# EAGLE design reLoaD_Spinner (EAGLE 9.7.0)
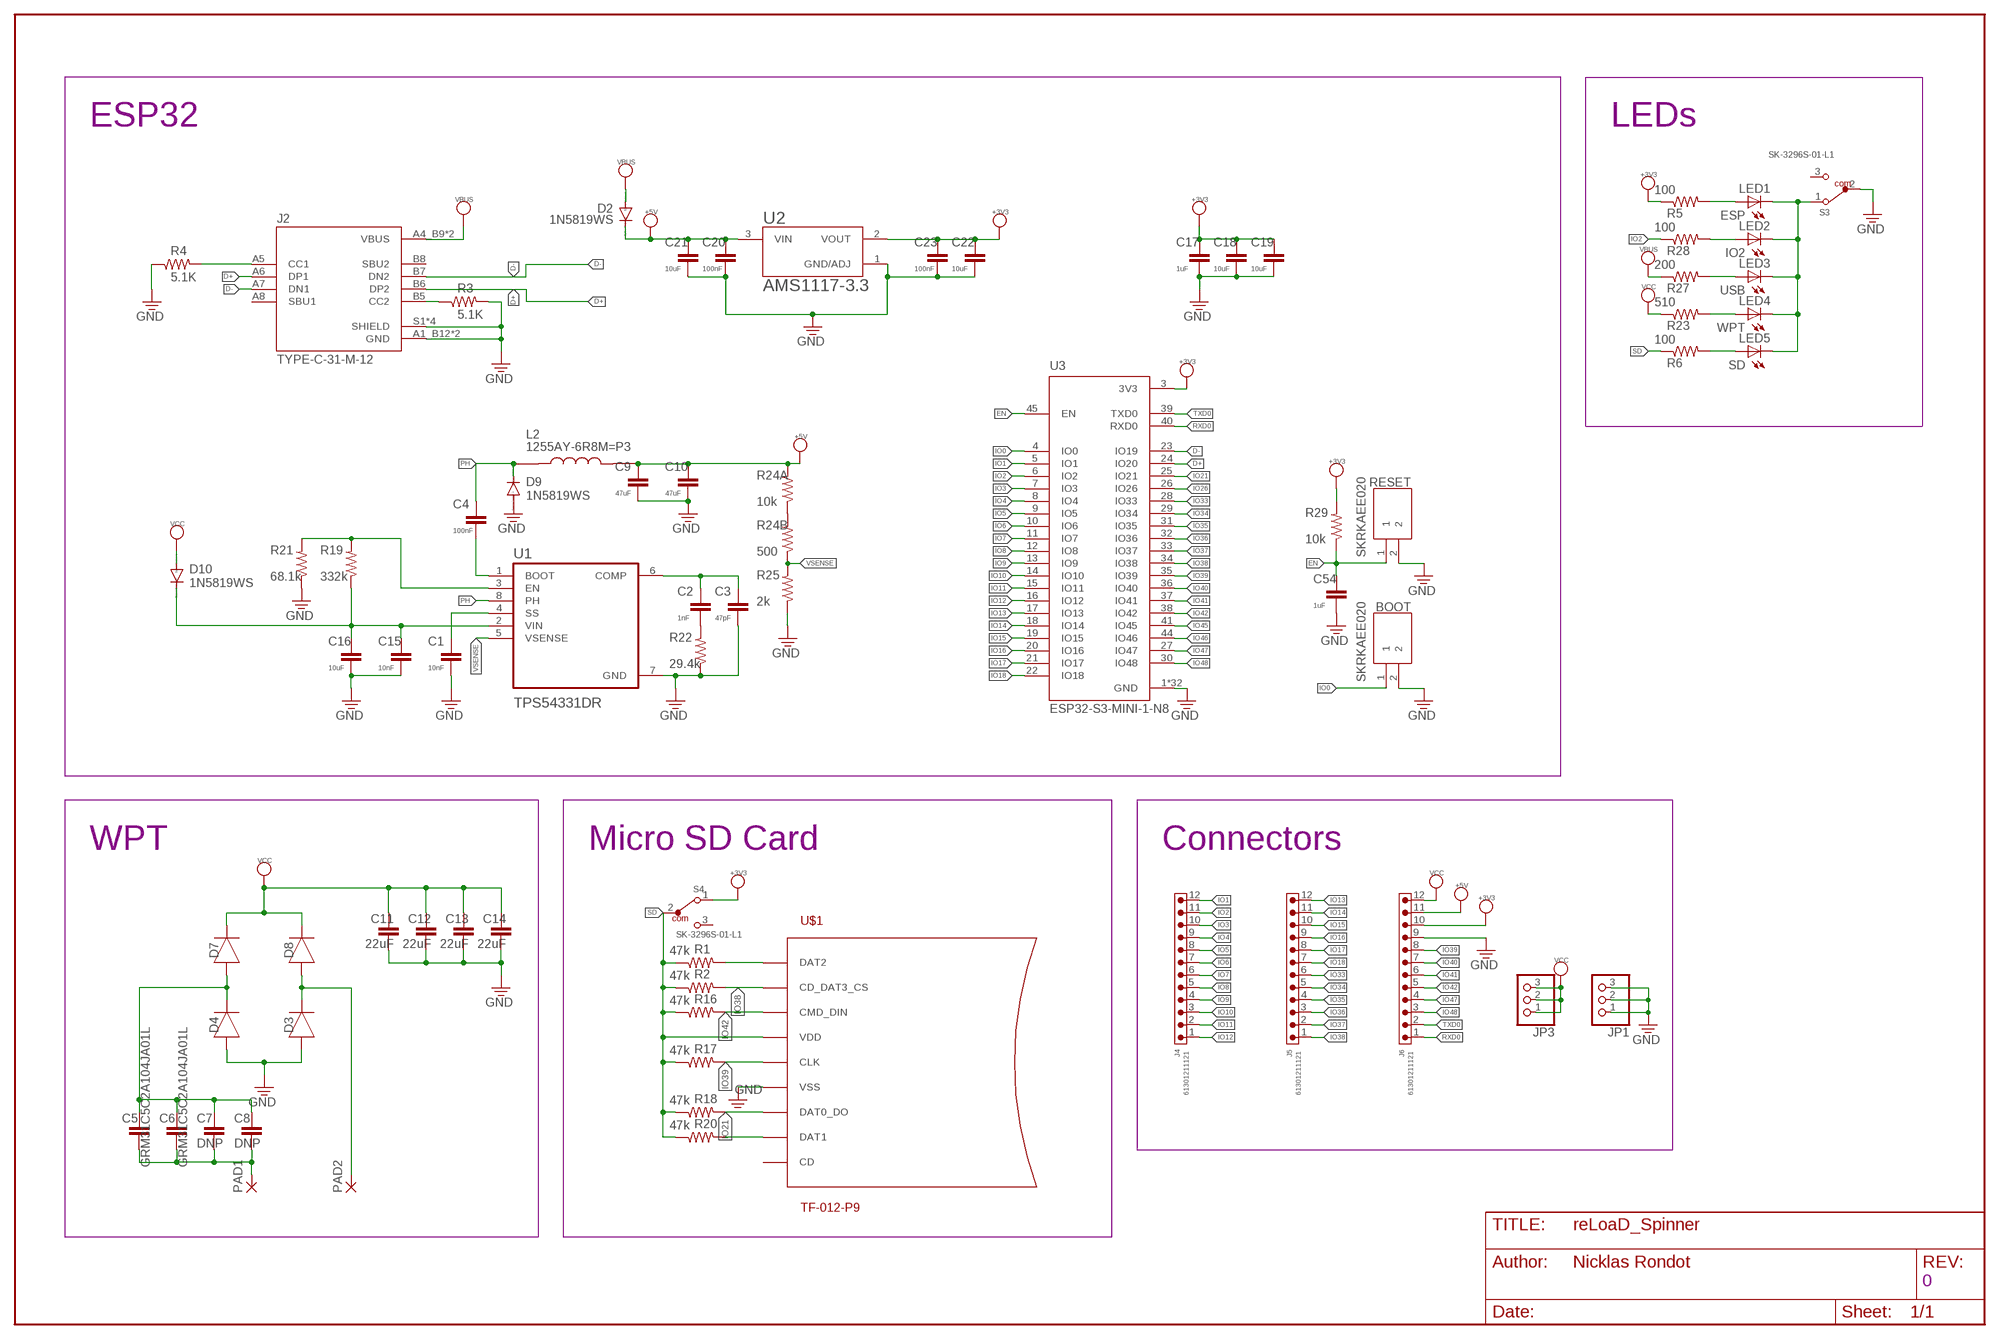
[diagram p0: schematic, sheet 1]

## Parts
BOOT  SKRKAEE020  [SKRKAEE020]
C1  10nF  C-EUC0603K  [C0603K]
C2  1nF  C-EUC0603K  [C0603K]
C3  47pF  C-EUC0603K  [C0603K]
C4  100nF  C-EUC0603K  [C0603K]
C5  GRM31C5C2A104JA01L  C-EUC1206K  [C1206K]
C6  GRM31C5C2A104JA01L  C-EUC1206K  [C1206K]
C7  DNP  C-EUC1206K  [C1206K]
C8  DNP  C-EUC1206K  [C1206K]
C9  47uF  C-EUC0603K  [C0603K]
C10  47uF  C-EUC0603K  [C0603K]
C11  22uF  C-EUC0805K  [C0805K]
C12  22uF  C-EUC0805K  [C0805K]
C13  22uF  C-EUC0805K  [C0805K]
C14  22uF  C-EUC0805K  [C0805K]
C15  10nF  C-EUC0603K  [C0603K]
C16  10uF  C-EUC0603K  [C0603K]
C17  1uF  C-EUC0603K  [C0603K]
C18  10uF  C-EUC0603K  [C0603K]
C19  10uF  C-EUC0603K  [C0603K]
C20  100nF  C-EUC0603K  [C0603K]
C21  10uF  C-EUC0603K  [C0603K]
C22  10uF  C-EUC0603K  [C0603K]
C23  100nF  C-EUC0603K  [C0603K]
C54  1uF  C-EUC0603K  [C0603K]
D2  1N5819WS  DIODE-SOD323-W  [SOD323-W]
D3  DIODE  DIODEDO-214AC(SMA)  [DIOM5226X290N]
D4  DIODE  DIODEDO-214AC(SMA)  [DIOM5226X290N]
D7  DIODE  DIODEDO-214AC(SMA)  [DIOM5226X290N]
D8  DIODE  DIODEDO-214AC(SMA)  [DIOM5226X290N]
D9  1N5819WS  DIODE-SOD323-W  [SOD323-W]
D10  1N5819WS  DIODE-SOD323-W  [SOD323-W]
J2  TYPE-C-31-M-12  [HRO_TYPE-C-31-M-12]
J4  61301211121  6130XX11121_61301211121  [61301211121]
J5  61301211121  6130XX11121_61301211121  [61301211121]
J6  61301211121  6130XX11121_61301211121  [61301211121]
JP1  PINHD-1X3  [1X03]
JP3  PINHD-1X3  [1X03]
L2  1255AY-6R8M=P3  [IND_1255AY-6R8M=P3]
LED1  ESP  LEDCHIPLED_0805  [CHIPLED_0805]
LED2  IO2  LEDCHIPLED_0805  [CHIPLED_0805]
LED3  USB  LEDCHIPLED_0805  [CHIPLED_0805]
LED4  WPT  LEDCHIPLED_0805  [CHIPLED_0805]
LED5  SD  LEDCHIPLED_0805  [CHIPLED_0805]
PAD1  3,81/1,4  [3,81/1,4]
PAD2  3,81/1,4  [3,81/1,4]
R1  47k  R-US_R0603  [R0603]
R2  47k  R-US_R0603  [R0603]
R3  5.1K  R-US_R0603  [R0603]
R4  5.1K  R-US_R0603  [R0603]
R5  100  R-US_R0603  [R0603]
R6  100  R-US_R0603  [R0603]
R16  47k  R-US_R0603  [R0603]
R17  47k  R-US_R0603  [R0603]
R18  47k  R-US_R0603  [R0603]
R19  332k  R-US_R0603  [R0603]
R20  47k  R-US_R0603  [R0603]
R21  68.1k  R-US_R0603  [R0603]
R22  29.4k  R-US_R0603  [R0603]
R23  510  R-US_R0603  [R0603]
R24A  10k  R-US_R0603  [R0603]
R24B  500  R-US_R0603  [R0603]
R25  2k  R-US_R0603  [R0603]
R27  200  R-US_R0603  [R0603]
R28  100  R-US_R0603  [R0603]
R29  10k  R-US_R0603  [R0603]
RESET  SKRKAEE020  [SKRKAEE020]
S3  SK-3296S-01-L1  450404015514  [450404015514]
S4  SK-3296S-01-L1  450404015514  [450404015514]
U1  TPS54331DR  [SOIC127P599X175-8N]
U2  AMS1117-3.3  [SOT229P700X180-4N]
U3  ESP32-S3-MINI-1-N8  [XCVR_ESP32-S3-MINI-1-N8]
U$1  TF-012-P9  [MICROSD-PUSH-OUT]

## Nets
+3V3: C17.1 C18.1 C19.1 C22.1 C23.1 J6.10 R5.1 R29.2 S4.1 U2.2(VOUT) U3.3(3V3)
+5V: C9.1 C10.1 C20.1 C21.1 D2.C J6.11 L2.2 R24A.2 U2.3(VIN)
COIL1: C5.2 C6.2 C7.2 C8.2 PAD1.1(P)
COIL2: D3.1(C) D8.2(A) PAD2.1(P)
D+: J2.A6(DP1) J2.B6(DP2) U3.24(IO20)
D-: J2.A7(DN1) J2.B7(DN2) U3.23(IO19)
DAT2: R1.2 U$1.1(DAT2)
EN: C54.1 R29.1 RESET.1 U3.45(EN)
GND: BOOT.2 C1.2 C3.2 C9.2 C10.2 C11.1 C12.1 C13.1 C14.1 C15.2 C16.2 C17.2 C18.2 C19.2 C20.2 C21.2 C22.2 C23.2 C54.2 D3.2(A) D4.2(A) D9.A J2.A1_B12(GND) J2.B1_A12(GND) J2.S1(SHIELD) J2.S2(SHIELD) J2.S3(SHIELD) J2.S4(SHIELD) J6.9 JP1.1 JP1.2 JP1.3 R3.2 R4.1 R21.1 R22.1 R25.1 RESET.2 S3.2 U1.7(GND) U2.1(GND/ADJ) U3.1(GND) U3.2(GND) U3.42(GND) U3.43(GND) U3.46(GND) U3.47(GND) U3.48(GND) U3.49(GND) U3.50(GND) U3.51(GND) U3.52(GND) U3.53(GND) U3.54(GND) U3.55(GND) U3.56(GND) U3.57(GND) U3.58(GND) U3.59(GND) U3.60(GND) U3.61(GND) U3.61_1(GND) U3.61_2(GND) U3.61_3(GND) U3.61_4(GND) U3.61_5(GND) U3.61_6(GND) U3.61_7(GND) U3.61_8(GND) U3.62(GND) U3.63(GND) U3.64(GND) U3.65(GND) U$1.6(VSS) U$1.G1(VSS) U$1.G2(VSS) U$1.G3(VSS) U$1.G4(VSS)
IO0: BOOT.1 U3.4(IO0)
IO1: J4.12 U3.5(IO1)
IO2: J4.11 R28.1 U3.6(IO2)
IO3: J4.10 U3.7(IO3)
IO4: J4.9 U3.8(IO4)
IO5: J4.8 U3.9(IO5)
IO6: J4.7 U3.10(IO6)
IO7: J4.6 U3.11(IO7)
IO8: J4.5 U3.12(IO8)
IO9: J4.4 U3.13(IO9)
IO10: J4.3 U3.14(IO10)
IO11: J4.2 U3.15(IO11)
IO12: J4.1 U3.16(IO12)
IO13: J5.12 U3.17(IO13)
IO14: J5.11 U3.18(IO14)
IO15: J5.10 U3.19(IO15)
IO16: J5.9 U3.20(IO16)
IO17: J5.8 U3.21(IO17)
IO18: J5.7 U3.22(IO18)
IO21: R18.2 U3.25(IO21) U$1.7(DAT0_DO)
IO26: U3.26(IO26)
IO33: J5.6 U3.28(IO33)
IO34: J5.5 U3.29(IO34)
IO35: J5.4 U3.31(IO35)
IO36: J5.3 U3.32(IO36)
IO37: J5.2 U3.33(IO37)
IO38: J5.1 R2.2 U3.34(IO38) U$1.2(CD_DAT3_CS)
IO39: J6.8 R17.2 U3.35(IO39) U$1.5(CLK)
IO40: J6.7 U3.36(IO40)
IO41: J6.6 U3.37(IO41)
IO42: J6.5 R16.2 U3.38(IO42) U$1.3(CMD_DIN)
IO45: U3.41(IO45)
IO46: U3.44(IO46)
IO47: J6.4 U3.27(IO47)
IO48: J6.3 U3.30(IO48)
N$1: LED3.A R27.2
N$2: LED4.A R23.2
N$4: J2.B5(CC2) R3.1
N$5: LED1.C LED2.C LED3.C LED4.C LED5.C S3.1
N$6: LED2.A R28.2
N$7: R19.2 R21.2 U1.3(EN)
N$8: C1.1 U1.4(SS)
N$9: R20.2 U$1.8(DAT1)
N$10: C2.1 C3.1 U1.6(COMP)
N$11: C2.2 R22.2
N$12: LED5.A R6.2
N$13: LED1.A R5.2
N$14: R24A.1 R24B.2
N$25: C5.1 C6.1 C7.1 C8.1 D4.1(C) D7.2(A)
N$30: C4.2 U1.1(BOOT)
N$35: C15.1 C16.1 D10.C R19.1 U1.2(VIN)
N$80: J2.A5(CC1) R4.2
PH: C4.1 D9.C L2.1 U1.8(PH)
RXD0: J6.1 U3.40(RXD0)
SD: R1.1 R2.1 R6.1 R16.1 R17.1 R18.1 R20.1 S4.2 U$1.4(VDD)
TXD0: J6.2 U3.39(TXD0)
VBUS: D2.A J2.A4_B9(VBUS) J2.B4_A9(VBUS) R27.1
VCC: C11.2 C12.2 C13.2 C14.2 D7.1(C) D8.1(C) D10.A J6.12 JP3.1 JP3.2 JP3.3 R23.1
VSENSE: R24B.1 R25.2 U1.5(VSENSE)
Unconnected: J2.A8(SBU1) J2.B8(SBU2) S3.3 S4.3 U$1.CD

## Notes on the sheet
- ESP32 | LEDs
- WPT | Micro SD Card | Connectors
- 0

## Library data of the parts
BOOT RESET = SKRKAEE020:SKRKAEE020: Tactile Switches 3.9x2.9x2.0mm 160gf Packaging Temp 80oC Source: Datasheet; DESCRIPTION: Tactile Switches 3.9x2.9x2.0mm 160gf Packaging Temp 80oC; HEIGHT: 2mm; MANUFACTURER_NAME: ALPS Electric; MANUFACTURER_PART_NUMBER: SKRKAEE020; MOUSER_PART_NUMBER: 688-SKRKAEE020; MOUSER_PRICE-STOCK: https://www.mouser.co.uk/ProductDetail/Alps-Alpine/SKRKAEE020?qs=MrosSN5%252BUQW89XjXIp8Ugw%3D%3D
C1-C4 C9 C10 C15-C23 C54 = resistor:C-EU: CAPACITOR, European symbol
C5-C8 C11-C14 = rcl:C-EU: CAPACITOR, European symbol; SPICEPREFIX: C
D2 D9 D10 = diode:DIODE-: DIODE
D3 D4 D7 D8 = Tinkercad:DIODE: Diode Rectifier - Generic; CATEGORY: Diode; SUB-CATEGORY: Rectifier
J2 = TYPE-C-31-M-12:TYPE-C-31-M-12: Check availability; AVAILABILITY: Not in stock; DESCRIPTION: USB Connectors 24 Receptacle 1 8.94*7.3mm RoHS; MF: HRO Electronics Co., Ltd.; MP: TYPE-C-31-M-12; PACKAGE: Package; PRICE: None
J4-J6 = Wurth_Connectors_WR-PHD:6130XX11121_61301211121: WR-PHD 2.54 mm THT Pin Header ARTICLE PROPERTIES: Pins:1;​ 2;​ 3;​ 4;​ 5;​ 6;​ 7;​ 8;​ 9;​ 10;​ 12;​ 13;​ 14;​ 15;​ 16;​ 18;​ 20;​ 22;​ 24;​ 25;​ 32;​ 36;​ 40 KIND PROPERTIES: Pitch：2.54 mm Quality Class:3 as per CECC 75 301-802 Rows：Single Gender：Pin Header Type：Straight MATERIAL PROPERTIES: Insulator Material PA6T; PBT Insulator Flammability Rating:UL94 V-0 Contact Material:Copper Alloy Contact Plating:Gold Contact Type:Stamped GENERAL INFORMATION Operating Temperature:-40 up to +105 °C ELECTRICAL PROPERTIES: Withstanding Voltage 500 V (AC) Contact Resistance 20 mΩ RISO 1000 MΩ CERTIFICATION UL Approval:E323964 PACKAGING PROPERTIES Packaging:Bag Details see: https://www.we-online.com/katalog/en/em/PHD_2_54_THT_PIN_HEADER_6130XX11121 Updated by Ella Wu 2021-12-08 2021 (C) Würth Elektronik; DATASHEET-URL: https://www.we-online.com/redexpert/spec/61301211121?ae; GENDER: Pin Header; IR: 3A; MOUNT: THT; PACKAGING: Bag; PART-NUMBER: 61301211121; PINS: 12; PITCH: 2.54mm; ROWS: Single; TYPE: Straight
JP1 JP3 = pinhead:PINHD-1X3: PIN HEADER
L2 = 1255AY-6R8M=P3:1255AY-6R8M=P3: 3.9µH Shielded Wirewound Inductor 4.2A 26.4mOhm Max Nonstandard Check availability; AVAILABILITY: Not in stock; CHECK_PRICES: https://www.snapeda.com/parts/1255AY-6R8M=P3/Murata+Electronics+North+America/view-part/?ref=eda; DESCRIPTION: 6.8 µH Shielded Drum Core, Wirewound Inductor 3.4 A 36mOhm Nonstandard; MF: Murata Electronics; MP: 1255AY-6R8M=P3; PACKAGE: NONSTANDARD; PRICE: None; PURCHASE-URL: https://www.snapeda.com/api/url_track_click_mouser/?unipart_id=1508412&manufacturer=Murata Electronics&part_name=1255AY-6R8M=P3&search_term=1255ay-6r8m=p3; SNAPEDA_LINK: https://www.snapeda.com/parts/1255AY-6R8M=P3/Murata+Electronics+North+America/view-part/?ref=snap
LED1-LED5 = adafruit:LED: LED OSRAM: - CHIPLED LG R971, LG N971, LY N971, LG Q971, LY Q971, LO R971, LY R971 LH N974, LH R974 LS Q976, LO Q976, LY Q976 LO Q996 - Hyper CHIPLED LW Q18S LB Q993, LB Q99A, LB R99A - SideLED LS A670, LO A670, LY A670, LG A670, LP A670 LB A673, LV A673, LT A673, LW A673 LH A674 LY A675 LS A676, LA A676, LO A676, LY A676, LW A676 LS A679, LY A679, LG A679 - Hyper Micro SIDELED® LS Y876, LA Y876, LO Y876, LY Y876 LT Y87S - SmartLED LW L88C, LW L88S LB L89C, LB L89S, LG L890 LS L89K, LO L89K, LY L89K LS L896, LA L896, LO L896, LY L896 - TOPLED LS T670, LO T670, LY T670, LG T670, LP T670 LSG T670, LSP T670, LSY T670, LOP T670, LYG T670 LG T671, LOG T671, LSG T671 LB T673, LV T673, LT T673, LW T673 LH T674 LS T676, LA T676, LO T676, LY T676, LB T676, LH T676, LSB T676, LW T676 LB T67C, LV T67C, LT T67C, LS T67K, LO T67K, LY T67K, LW E67C LS E67B, LA E67B, LO E67B, LY E67B, LB E67C, LV E67C, LT E67C LW T67C LS T679, LY T679, LG T679 LS T770, LO T770, LY T770, LG T770, LP T770 LB T773, LV T773, LT T773, LW T773 LH T774 LS E675, LA E675, LY E675, LS T675 LS T776, LA T776, LO T776, LY T776, LB T776 LHGB T686 LT T68C, LB T68C - Hyper Mini TOPLED® LB M676 - Mini TOPLED Santana® LG M470 LS M47K, LO M47K, LY M47K Source: http://www.osram.convergy.de/
PAD1 PAD2 = wirepad:3,81/1,4: THROUGH-HOLE PAD
R1-R6 R16-R23 R24A R24B R25 R27-R29 = resistor:R-US_: RESISTOR, American symbol
S3 S4 = Wurth_Switch_WS-SLSU:450404015514: WS-SLSU Mini Slide Switch, Same Side Connection Side Push 6.7x2.7 mm Properties Actuator Material:PA46 Actuator Flammability Rating:UL94 HB Actuator Color:Black Frame Material:LCP Frame Flammability Rating:UL94 V-0 Frame Color:Black Contact Material:Copper Alloy Contact Plating:Silver Terminal Material:Copper Alloy Terminal Plating:Silver Switching Function:On-On Schematic:SPDT Connection Type:Same Side Connection Qty.:3300 Material Properties Cover Material:Stainless Steel General Information Operating Temperature:-40 up to +85 °C Packaging Properties Packaging :Tape and Reel Details see: https://www.we-online.com/catalog/en/SLSU_6_7X_2_7_SMD_HORIZONTAL/ Updated by yingchun,Shan;2020-02-25 2020(C) Würth Elektronik; DATASHEET-URL: https://www.we-online.com/catalog/datasheet/450404015514.pdf; IR: 300mA; PACKAGING: Tape and Reel; PART-NUMBER: 450404015514; QTY: 150; VR: 5V(DC)
U1 = TPS54331DR:TPS54331DR: Check availability; AVAILABILITY: In Stock; CHECK_PRICES: https://www.snapeda.com/parts/TPS54331DR/Texas+Instruments/view-part/?ref=eda; DESCRIPTION: 3.5V to 28V Input, 3A, 570kHz Step-Down Converter with Eco-mode; MF: Texas Instruments; MP: TPS54331DR; PACKAGE: SOIC-8 Texas Instruments; PRICE: None; PURCHASE-URL: https://www.snapeda.com/api/url_track_click_mouser/?unipart_id=490779&manufacturer=Texas Instruments&part_name=TPS54331DR&search_term=tps54331dr; SNAPEDA_LINK: https://www.snapeda.com/parts/TPS54331DR/Texas+Instruments/view-part/?ref=snap
U2 = AMS1117-3.3:AMS1117-3.3: Check availability; AVAILABILITY: Not in stock; CHECK_PRICES: https://www.snapeda.com/parts/AMS1117-3.3/Advanced+Monolithic+Systems/view-part/?ref=eda; DESCRIPTION: Sot223/Pkg 1-Amp 3.3-Volt Low Drop Out Voltage Regulatator; MF: Advanced Monolithic Systems; MP: AMS1117-3.3; PACKAGE: SOT-223 Seeed Technology; PRICE: None; SNAPEDA_LINK: https://www.snapeda.com/parts/AMS1117-3.3/Advanced+Monolithic+Systems/view-part/?ref=snap
U3 = ESP32-S3-MINI-1-N8:ESP32-S3-MINI-1-N8: Bluetooth, WiFi 802.11b/g/n, Bluetooth v5.0 Transceiver Module 2.4GHz PCB Trace Surface Mount Check availability; AVAILABILITY: In Stock; CHECK_PRICES: https://www.snapeda.com/parts/ESP32-S3-MINI-1-N8/Espressif+Systems/view-part/?ref=eda; DESCRIPTION: Bluetooth, WiFi 802.11b/g/n, Bluetooth v5.0 Transceiver Module 2.4GHz PCB Trace Surface Mount; MF: Espressif Systems; MP: ESP32-S3-MINI-1-N8; PACKAGE: None; PRICE: None; PURCHASE-URL: https://www.snapeda.com/api/url_track_click_mouser/?unipart_id=8941370&manufacturer=Espressif Systems&part_name=ESP32-S3-MINI-1-N8&search_term= esp32-s3-mini-1-n8; SNAPEDA_LINK: https://www.snapeda.com/parts/ESP32-S3-MINI-1-N8/Espressif+Systems/view-part/?ref=snap
U$1 = TF-012-P9:TF-012-P9: T-Flash Push-Out Micro SD Card Reader 14.75mm x 14.5mm SMD with external pins

## Board
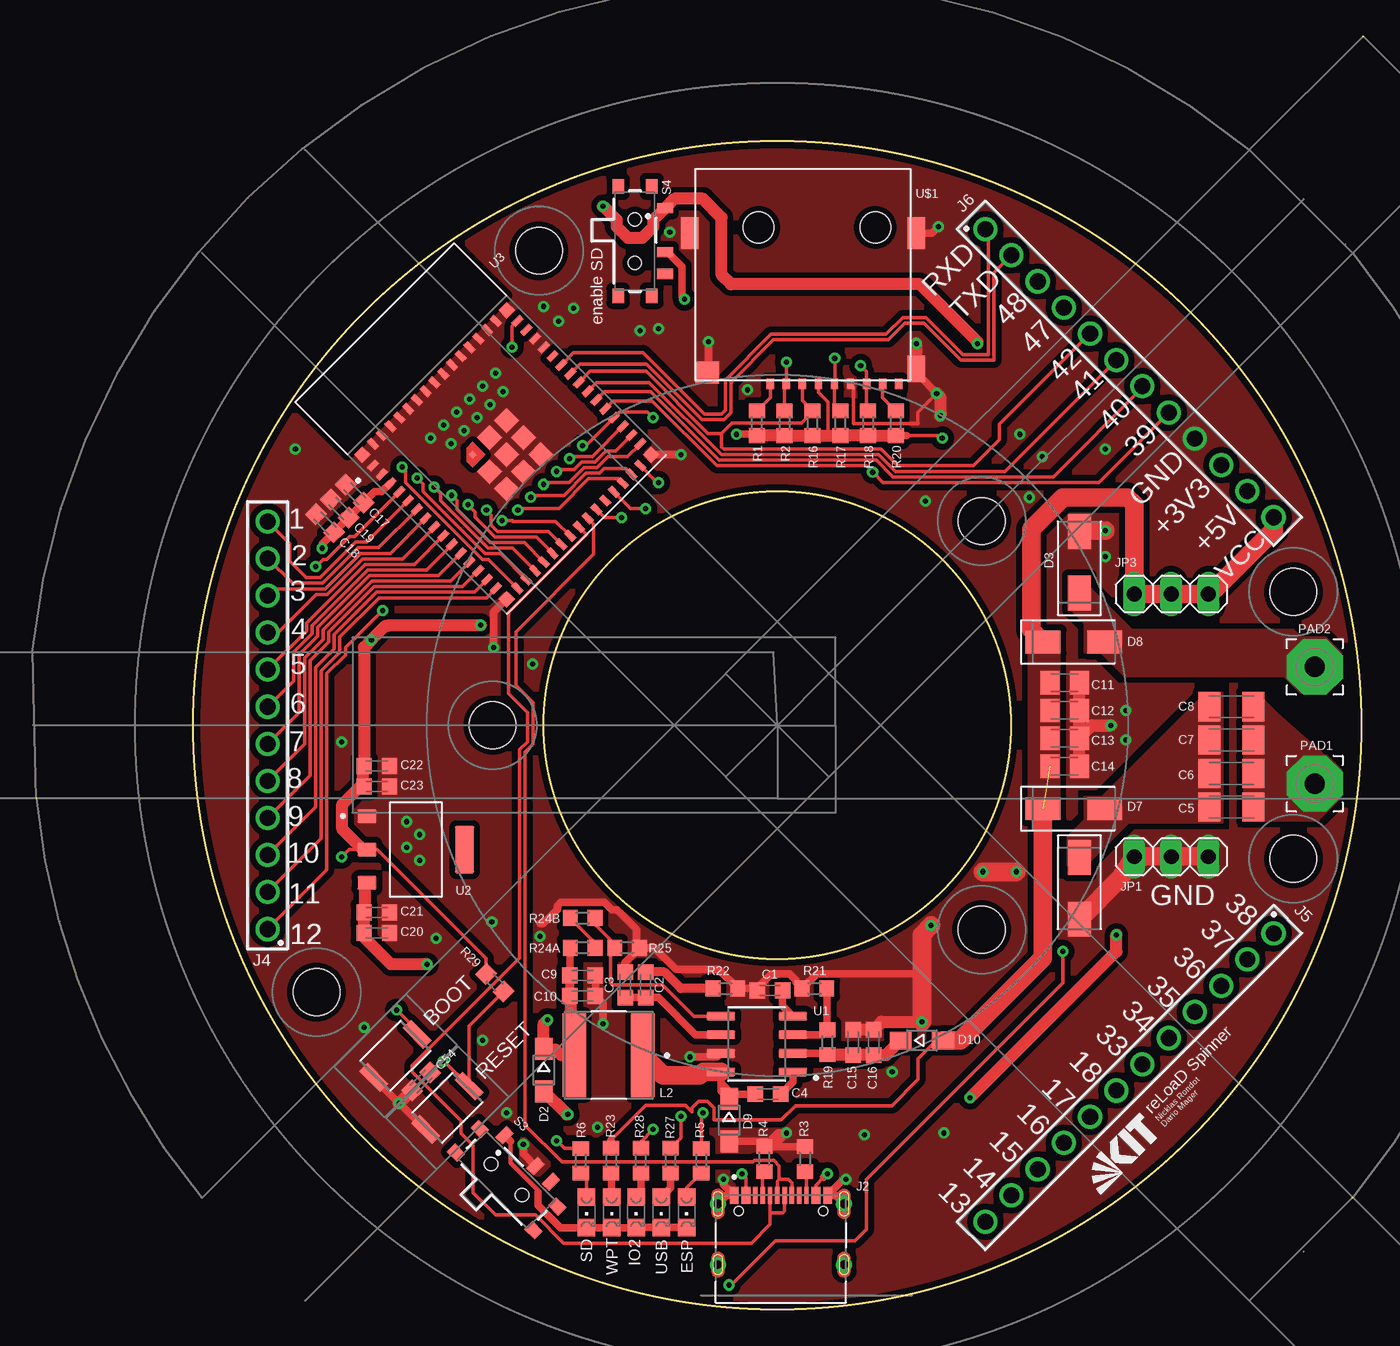
[diagram p1: board, top side]
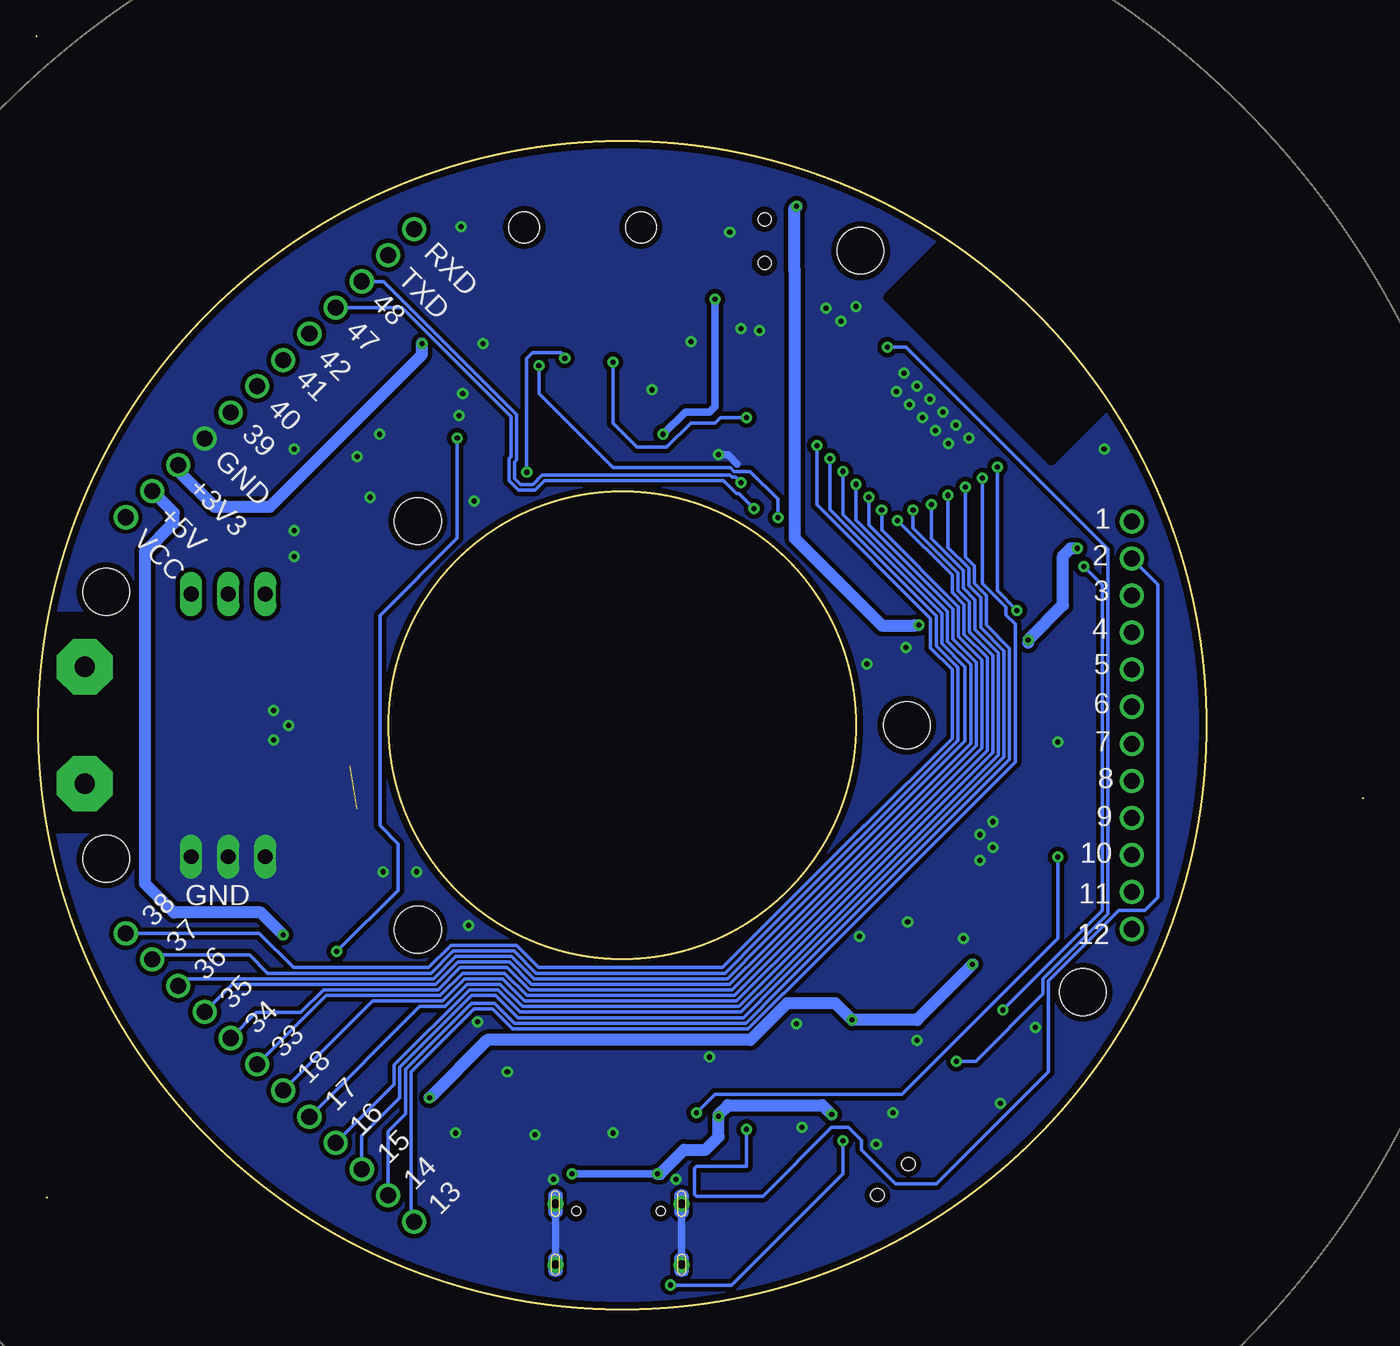
[diagram p2: board, bottom side, seen from below]

Size 90.89 x 87.2 mm. Coordinates in mm from the lower left corner, seen from the top.
Outline: 90.19,7.64 90.19,7.64
Outline: 90.88,87.2 90.89,87.2
Outline: 0,35 0,35.01
Outline: circle at 50.76,40 radius 16
Outline: circle at 50.76,40 radius 40
Copper layers (1*16): Top 0.035mm / dielectric 1.5mm / Bottom 0.035mm
Design rules "Fusion Electronics Design Rules": minimum track width 6mil, minimum drill 0.35mm, track to track 5mil, track to pad 5mil, pad to pad 5mil, via to via 0.5mm, smd to smd 5mil, copper to edge 0.4mm, drill to drill 0.5mm, minimum pad ring 10mil, minimum via ring 8mil, stop-mask expansion 4mil, vias tented up to drill 0mil, thermal gap 10mil
Holes 3.2 mm at 64.76,26 64.76,54 31.26,40 34.43,72.51 86.12,49.14 86.12,30.86 19.19,21.71
bRestrict: area 17.5,58.2 to 32.5,73.2; area 85.8,33 to 89.4,47.4

### Footprints (pad centres in the part's own frame; a part is rotated, then mirrored left to right if it is on the bottom)
SKRKAEE020 = smd 0.8 x 2: 1 -2.1,0; 2 2.1,0
C0603K = smd 1.05 x 1.08: 1 -0.875,0; 2 0.875,0
C1206K = smd 1.5 x 2: 1 -1.5,0; 2 1.5,0
C0805K = smd 1.3 x 1.6: 1 -1,0; 2 1,0
SOD323-W = smd 1.5 x 1.2: A 1.45,0; C -1.45,0
DIOM5226X290N = smd 2.392 x 1.565: 1 -2.108,0; 2 2.108,0
HRO_TYPE-C-31-M-12 = smd 0.6 x 1.14: A1_B12 -3.2,4.75; A4_B9 -2.4,4.75; B1_A12 3.2,4.75; B4_A9 2.4,4.75 | smd 0.3 x 1.14: A5 -1.25,4.75; A6 -0.25,4.75; A7 0.25,4.75; A8 1.25,4.75; B5 1.75,4.75; B6 0.75,4.75; B7 -0.75,4.75; B8 -1.75,4.75 | drill 0.6 pad 0.9: S1 -4.325,4.17; S2 4.325,4.17; S3 -4.325,0; S4 4.325,0 | hole 0.6: -2.89,3.68; 2.89,3.68
61301211121 = drill 1.1: 1 -13.97,0; 2 -11.43,0; 3 -8.89,0; 4 -6.35,0; 5 -3.81,0; 6 -1.27,0; 7 1.27,0; 8 3.81,0; 9 6.35,0; 10 8.89,0; 11 11.43,0; 12 13.97,0
1X03 = drill 1.016 long: 1 -2.54,0; 2 0,0; 3 2.54,0
IND_1255AY-6R8M=P3 = smd 1.6 x 5.7: 1 -2.35,0; 2 2.35,0
CHIPLED_0805 = smd 1.2 x 1.2: A 0,-1.05; C 0,1.05
3,81/1,4 = drill 1.397 pad 3.81 octagon: 1 0,0
R0603 = smd 1 x 1.1: 1 -0.85,0; 2 0.85,0
450404015514 = smd 0.7 x 1.1: 1 2.25,-2.05; 2 -0.75,-2.05; 3 -2.25,-2.05 | smd 1 x 0.8: Z1 -3.75,1.15; Z2 3.75,1.15; Z3 3.75,-1.15; Z4 -3.75,-1.15 | hole 0.9: -1.5,0; 1.5,0
SOIC127P599X175-8N = smd 1.97 x 0.6: 1 -2.47,1.905; 2 -2.47,0.635; 3 -2.47,-0.635; 4 -2.47,-1.905; 5 2.47,-1.905; 6 2.47,-0.635; 7 2.47,0.635; 8 2.47,1.905
SOT229P700X180-4N = smd 1.31 x 0.93: 1 -3.345,2.29; 2 -3.345,0; 3 -3.345,-2.29 | smd 1.31 x 3.24: 4 3.345,0
XCVR_ESP32-S3-MINI-1-N8 = smd 0.8 x 0.4: 1 -7,5.95; 2 -7,5.1; 3 -7,4.25; 4 -7,3.4; 5 -7,2.55; 6 -7,1.7; 7 -7,0.85; 8 -7,0; 9 -7,-0.85; 10 -7,-1.7; 11 -7,-2.55; 12 -7,-3.4; 13 -7,-4.25; 14 -7,-5.1; 15 -7,-5.95; 31 7,-5.95; 32 7,-5.1; 33 7,-4.25; 34 7,-3.4; 35 7,-2.55; 36 7,-1.7; 37 7,-0.85; 38 7,0; 39 7,0.85; 40 7,1.7; 41 7,2.55; 42 7,3.4; 43 7,4.25; 44 7,5.1; 45 7,5.95 | smd 0.4 x 0.8: 16 -5.95,-7; 17 -5.1,-7; 18 -4.25,-7; 19 -3.4,-7; 20 -2.55,-7; 21 -1.7,-7; 22 -0.85,-7; 23 0,-7; 24 0.85,-7; 25 1.7,-7; 26 2.55,-7; 27 3.4,-7; 28 4.25,-7; 29 5.1,-7; 30 5.95,-7; 46 5.95,7; 47 5.1,7; 48 4.25,7; 49 3.4,7; 50 2.55,7; 51 1.7,7; 52 0.85,7; 53 0,7; 54 -0.85,7; 55 -1.7,7; 56 -2.55,7; 57 -3.4,7; 58 -4.25,7; 59 -5.1,7; 60 -5.95,7 | smd 1.2 x 1.2: 61 0,0; 61_2 0,1.65; 61_3 1.65,1.65; 61_4 1.65,0; 61_5 1.65,-1.65; 61_6 0,-1.65; 61_7 -1.65,-1.65; 61_8 -1.65,0 | smd 0.4 x 0.4: 61_1 -1.65,1.65 | smd 0.8 x 0.8: 62 -7,7; 63 -7,-7; 64 7,-7; 65 7,7
MICROSD-PUSH-OUT = smd 0.5 x 0.75: 1 9.625,0.225; 2 8.525,0.225; 3 7.425,0.225; 4 6.325,0.225; 5 5.225,0.225; 6 4.125,0.225; 7 3.025,0.225; 8 1.925,0.225; CD 0.825,0.225 | smd 1.2 x 1.8: G1 -0.375,-0.8 | smd 1.2 x 2.2: G2 -0.375,-10.1; G4 15.125,-10.1 | smd 1.6 x 1.5: G3 13.95,-0.55 | hole 2.1: 2.429,-10.496; 10.419,-10.495

### Placement (x,y rotation side)
BOOT  24.6,17.35 225 top
C1  50.25,21.84 180 top
C2  41.74,22.22 90 top
C3  40.34,22.22 90 top
C4  50.12,14.73 0 top
C5  81.87,34.41 0 top
C6  81.87,36.7 0 top
C7  81.87,38.98 0 top
C8  81.87,41.27 0 top
C9  37.42,22.86 0 top
C10  37.42,21.46 0 top
C11  70.44,42.92 180 top
C12  70.44,41.02 180 top
C13  70.44,39.11 180 top
C14  70.44,37.21 180 top
C15  55.96,18.28 90 top
C16  57.36,18.28 90 top
C17  21.8,55.88 135 top
C18  19.77,53.84 135 top
C19  20.79,54.86 135 top
C20  23.33,25.78 0 top
C21  23.33,27.17 0 top
C22  23.33,37.21 0 top
C23  23.33,35.81 0 top
C54  26.35,15.59 225 top
D2  34.76,16.38 270 top
D3  71.46,51.18 90 top
D4  71.46,28.82 270 top
D7  71.08,34.28 0 top
D8  71.08,45.72 0 top
D9  47.46,12.95 270 top
D10  60.66,18.41 0 top
J2  51.01,3.04 0 top
J4  15.84,40 90 top
J5  74.89,15.87 225 top
J6  74.89,64.13 315 top
JP1  77.76,31 0 top
JP3  77.76,49 0 top
L2  39.2,17.39 180 top
LED1  44.55,6.64 180 top
LED2  41.09,6.64 180 top
LED3  42.81,6.64 180 top
LED4  39.42,6.64 180 top
LED5  37.69,6.63 180 top
PAD1  87.59,36 0 top
PAD2  87.59,44 0 top
R1  49.36,60.7 90 top
R2  51.27,60.7 90 top
R3  52.66,10.28 90 top
R4  49.87,10.28 270 top
R5  45.55,10.16 270 top
R6  37.3,10.16 270 top
R16  53.17,60.7 90 top
R17  55.08,60.7 90 top
R18  56.98,60.7 90 top
R19  54.19,18.28 90 top
R20  58.89,60.7 90 top
R21  53.3,21.97 0 top
R22  47.2,21.97 180 top
R23  39.38,10.17 270 top
R24A  37.42,24.76 180 top
R24B  37.42,26.79 180 top
R25  40.47,24.76 180 top
R27  43.44,10.17 270 top
R28  41.41,10.17 270 top
R29  31.4,22.37 135 top
RESET  28.15,13.79 225 top
S3  32.21,8.87 135 top
S4  41.01,73.18 90 top
U1  49.36,18.16 180 top
U2  25.99,31.49 0 top
U3  32.22,58.54 45 top
U$1  59.9,63.62 180 top

### Tracks (layer width: path | path; a pad name or v marks a point on that pad's centre or on a via)
+3V3  (via drill 0.35)
  Top 0.254: R5.1 45.55,13.33 v45.68,13.46 | v20.91,30.98 21.42,31.49 U2.2 23.33,31.49 30.8,24.02 R29.2
  Top 0.508: U3.3 23.67,56 23.17,56 C17.1 C19.1 C18.1 19.58,52.42 v19.58,52.13
  Top 0.813: v64.47,66.16 64.47,66.29 60.54,70.23 47.58,70.23 46.95,70.86 46.95,74.8 45.68,76.07 43.7,76.07 S4.1 42.26,74.63 42.26,74.16 41.51,73.4 40.51,73.4 39.75,74.16 39.75,74.63 v38.82,75.56 | U2.2 22.34,31.49 20.95,32.88 20.95,34.58 22.18,35.81 C23.1 22.38,35.88 22.38,37.14 C22.1 22.44,37.22 22.44,45.33 v22.94,45.84 23.94,46.84 24.14,46.84 24.16,46.86 v30.44,46.86
  Bottom 0.254: v45.68,13.46 44.41,14.73 31.58,14.73 20.91,25.39 v20.91,30.98
  Bottom 0.813: v64.47,66.16 64.47,65.4 74.89,54.99 78.7,54.99 81.17,57.46 J6.10 | 22.94,45.66 v22.94,45.84 20.55,48.23 20.55,51.61 20.03,52.13 v19.58,52.13 | v38.82,75.56 38.99,75.39 38.99,71.16 38.95,71.2 38.95,52.83 32.95,46.84 30.77,46.84 30.75,46.86 v30.44,46.86
+5V  (via drill 0.35)
  Top 0.508: C9.1 36.55,24.73 R24A.2
  Top 0.61: C10.1 C9.1
  Top 0.813: v26.75,23.62 24.29,23.62 22.45,25.45 C20.1 C21.1 22.52,27.24 22.52,29.07 U2.3 | v63.97,14.47 74,24.51 v74,25.65 | v35.01,19.81 34.76,19.55 D2.C 34.81,17.77 35.58,17.77 35.96,17.39 L2.2 36.6,17.65 36.6,21.41 C10.1
  Bottom 0.813: v26.75,23.62 30.56,19.81 v35.01,19.81 36.15,20.95 39.45,20.95 41.97,18.43 60.01,18.43 v63.97,14.47 | v74,25.65 75.52,27.17 81.49,27.17 83.46,29.14 83.46,51.87 81.49,53.84 81.49,54.57 J6.11
COIL1
  pour Top (no thermals): 82.71,33.47 87.81,33.47 89.42,35.08 89.42,36.92 88.44,37.89 88.35,37.89 88.34,37.89 88.34,37.89 88.33,37.89 88.32,37.9 88.31,37.9 88.31,37.9 88.31,37.9 88.3,37.91 85.01,40.82 85,40.82 85,40.83 84.99,40.84 84.98,40.84 83.75,42.08 82.71,42.08
COIL2
  pour Top (no thermals): 85.44,43.38 85.47,43.37 86.6,42.24 88.32,42.24 89.42,43.33 89.42,44.92 88.32,46.02 86.68,46.02 86.66,46.03 86.16,46.53 75.13,46.53 75.1,46.54 71.81,49.83 70.77,49.83 70.77,48.03 71.78,47.03 71.79,47 71.79,45.03 72.87,45.03 72.9,45.02 74.54,43.38
D+
  Top 0.254: J2.A6 50.76,8.76 50.88,8.89 | 50.88,8.89 51.52,8.89 51.76,8.64 J2.B6 | U3.24 38.18,53.77 38.18,51.72 32.85,46.39 32.85,42.72 34.02,41.55 34.02,38.71 33.49,38.17 33.49,12.6 36.01,10.07 49.1,10.07 49.21,10.19 50.52,10.19 50.88,9.82 50.88,8.89
D-
  Top 0.254: 50.26,6.71 J2.B7 | 50.26,6.71 50.26,5.8 48.98,4.52 36.12,4.52 34.18,6.45 31.44,6.45 29.92,7.98 29.92,11.23 29.1,12.05 29.1,12.89 25.74,16.25 25.74,16.7 33.1,24.06 33.1,38.33 33.64,38.87 33.64,40.88 32.34,42.18 32.34,47.74 37.68,53.08 U3.23 | 50.26,6.71 50.38,6.6 51.14,6.6 51.26,6.72 J2.A7
DAT2
  Top 0.254: U$1.1 50.28,62.47 R1.2
EN  (via drill 0.35)
  Top 0.254: R29.1 29.64,19.4 RESET.1 27.94,16.97 v27.86,16.97 27.74,16.97 C54.1 | v32.6,65.91 32.6,67.34 U3.45
  Bottom 0.254: v27.86,16.97 26.54,16.97 21.93,21.59 21.93,22.63 17.48,27.08 17.48,52.07 31.33,65.91 v32.6,65.91
GND  (via drill 0.35)
  Top 0.254: 60.42,64.03 60.49,63.96 | U$1.6 55.96,63.21 55.96,60.67 60.41,60.67 60.41,61.46 v61.68,62.73
  Top 0.508: U$1.G2 61.37,73.72 v61.81,74.16 | 44.9,73.85 U$1.G4 | U$1.G3 46.06,64.28 v46.06,66.29 | U$1.G1 60.49,64.21 60.49,63.96 61.68,62.77 v61.68,62.73 | D9.A 50.83,11.5 v51.39,12.06 50.8,12.06 R4.1 R3.2 | J2.S1 47.27,7.79 J2.A1_B12 47.07,8.53 v47.07,8.89 | J2.S2 54.76,7.79 J2.B1_A12 55.3,8.89 v55.46,8.89 | v33.36,11.3 33.36,10.62 S3.2 | RESET.2 24.89,14.08 v24.85,14.08 24.85,14.09 23.11,15.83 BOOT.2 | C9.2 C10.2 38.82,20.94 v38.82,19.55 | R25.1 42.34,24.76 43.83,23.27 46.75,23.27 R22.1 49.25,21.97 C1.2 49.37,21.98 50.38,22.98 51.59,22.98 52.03,22.54 52.03,22.38 R21.1 53.46,22.98 60.54,22.98 60.66,22.86 | R25.1 41.34,24.74 40.34,23.74 C3.2 | R25.1 41.11,24.98 41.11,26.03 39.79,27.34 39.44,27.34 38.93,27.85 35.91,27.85 35.69,27.63 35.69,27.37 34.73,26.41 34.5,26.41 | U1.7 46.64,17.27 v44.79,17.27 | U3.64 v44.15,58.54 | U3.63 31.33,47.75 v31.33,45.33
  Top 0.813: C14.1 C13.1 | C13.1 C12.1 C11.1 | C13.1 72.33,40 v73.62,40 | U$1.G1 v60.28,66.16 | v61.68,62.73 61.93,62.48 v61.93,61.21 | C15.2 C16.2 57.88,19.68 v60.66,19.68 | v24.85,14.08 C54.2
  Top 1.27: v73.24,53.34 71.51,53.34 D3.2 | D4.2 74.24,29.5 JP1.1 JP1.2 JP1.3 | v60.66,19.68 60.66,22.86 60.66,25.65 v61.3,26.28 | v64.85,29.97 v67.14,29.97
  Bottom 0.508: J2.S1 J2.S3 | J2.S4 J2.S2 | v44.15,58.54 43.52,58.54 42.88,57.91
  other vias: 43.39,73.78 27.01,59.69 27.9,60.57 28.79,61.46 29.68,62.35 30.56,63.24 31.45,64.13 31.96,62.86 31.07,61.97 30.18,61.08 29.29,60.19 28.41,59.3 30.56,18.41 32.22,13.46 25.36,33.4 26.25,32.51 25.36,31.62 26.25,30.73 20.91,38.86 22.44,19.3 58.63,16.25 56.73,11.93 38.44,12.44 27.39,25.39 33.99,44.19 17.74,58.92 74.63,41.02 74.63,38.98 62.19,12.06 31.2,26.54 34.5,25.52 48.73,62.99 41.36,67.05 35.77,67.69 73.24,51.56 34.76,68.7 36.79,68.58 42.63,67.18 68.92,58.41 67.39,59.94 73.24,58.92 68.03,55.62 60.92,55.37
  pour Bottom (isolate 0.305, rank 2, no thermals): 47.83,-10.84 51.62,-10.92 55.4,-10.71 59.17,-10.22 62.88,-9.46 66.53,-8.42 70.09,-7.11 73.54,-5.55 76.86,-3.72 80.04,-1.66 83.06,0.63 83.07,0.64 83.07,0.64 83.08,0.65 83.09,0.65 83.09,0.65 90.12,7.68 90.12,7.68 90.13,7.69 92.36,10.62 94.38,13.7 96.16,16.92 97.71,20.27 99.01,23.71 100.06,27.24 100.86,30.84 101.39,34.48 101.65,38.16 101.65,41.84 101.39,45.51 100.86,49.16 100.06,52.76 99.01,56.29 97.71,59.73 96.16,63.07 94.37,66.29 92.36,69.38 90.12,72.3 90.12,72.31 90.12,72.32 90.11,72.32 90.11,72.33 83.07,79.37 80.05,81.67 76.87,83.73 73.54,85.56 70.08,87.13 66.52,88.44 62.87,89.48 59.16,90.25 55.4,90.73 51.61,90.94 47.81,90.86 44.04,90.5 40.3,89.87 36.62,88.95 33.01,87.76 29.51,86.31 26.12,84.6 22.87,82.65 19.77,80.46 16.85,78.04 14.11,75.41 11.57,72.59 9.26,69.58 7.17,66.42 5.33,63.1 3.73,59.66 2.4,56.1 1.34,52.46 0.55,48.75 0.03,44.99 0.03,35.08 0.04,35.07 0.04,35.07 0.05,35.07 0.05,35.06 0.06,35.06 0.07,35.05 0.07,35.05 0.07,35.04 0.08,35.03 0.08,35.02 0.08,35.02 0.08,35.01 0.59,31.26 1.38,27.55 2.45,23.91 3.78,20.36 5.37,16.92 7.21,13.6 9.3,10.43 11.61,7.43 14.14,4.61 16.88,1.98 19.8,-0.43 22.9,-2.62 26.15,-4.58 29.53,-6.29 33.03,-7.74 36.64,-8.93 40.32,-9.84 44.05,-10.48
  pour Top (isolate 0.406, rank 2, no thermals): 1.61,-5.85 102.83,-5.85 102.83,90.29 1.99,90.29 1.61,-5.72
IO0  (via drill 0.35)
  Top 0.254: BOOT.1 26.08,19.09 v24.68,20.48 | U3.4 21.79,52.93 21.45,52.93 19.89,51.37 19.63,51.37 v19.14,50.87
  Bottom 0.254: v24.68,20.48 17.87,27.3 17.87,49.6 v19.14,50.87
IO1
  Top 0.254: J4.12 17.36,52.45 17.36,51.24 18.49,50.11 19.45,50.11 21.88,52.55 22.61,52.55 U3.5
IO2  (via drill 0.35)
  Top 0.254: 41.3,11.13 R28.1 41.41,11.48 v42.25,12.31 | U3.6 23.44,52.17 22.04,52.17 19.61,49.73 17.54,49.73 J4.11
  Bottom 0.254: J4.11 14.05,49.65 14.05,28.19 14.94,27.3 16.72,27.3 21.55,22.47 21.55,16.25 29.23,8.57 32.03,8.57 34.37,10.92 34.37,11.55 35.26,12.44 36.43,12.44 41.13,7.74 45.68,7.74 45.8,7.87 45.8,9.65 45.68,9.77 42.25,9.77 v42.25,12.31
IO3
  Top 0.254: U3.7 24.26,51.79 22.2,51.79 19.77,49.35 16.3,49.35 J4.10
IO4
  Top 0.152: 18.61,48.4 18.5,48.3
  Top 0.254: J4.9 16.55,46.35 18.61,48.4 19.17,48.97 19.92,48.97 22.36,51.41 25.08,51.41 U3.8
IO5
  Top 0.254: J4.8 18.5,46.47 18.5,47.01 22.52,51.02 25.9,51.02 U3.9
IO6
  Top 0.254: J4.7 17.61,43.04 17.61,45.02 18.88,46.28 18.88,46.85 22.67,50.64 26.72,50.64 U3.10
IO7
  Top 0.152: 28.94,51.66 U3.11
  Top 0.254: J4.6 17.99,40.88 17.99,44.86 19.26,46.13 19.26,46.69 22.83,50.26 27.54,50.26 28.94,51.66
IO8
  Top 0.254: J4.5 18.37,38.73 18.37,44.6 19.64,45.87 19.64,46.53 22.99,49.88 28.36,49.88 U3.12
IO9
  Top 0.254: J4.4 18.75,36.57 18.75,44.45 20.02,45.72 20.02,46.38 23.15,49.5 29.18,49.5 U3.13
IO10
  Top 0.254: J4.3 19.13,34.41 19.13,43.97 20.4,45.24 20.4,46.22 23.3,49.12 30,49.12 U3.14
IO11
  Top 0.254: J4.2 19.52,32.25 19.52,43.71 20.79,44.98 20.79,46.06 23.46,48.74 30.83,48.74 U3.15
IO12  (via drill 0.35)
  Top 0.254: J4.1 19.9,30.09 19.9,43.56 21.17,44.83 21.17,45.34 v23.7,47.87 | v25.05,57.7 25.31,57.45 25.31,56.63 30.56,51.37 30.97,51.37 U3.16
  Bottom 0.254: v25.05,57.7 25.05,49.22 v23.7,47.87
IO13  (via drill 0.35)
  Top 0.254: v26.07,56.94 26.48,56.53 26.48,56.02 30.75,51.75 31.79,51.75 U3.17
  Bottom 0.254: J5.12 65.24,6.22 65.24,16.25 60.92,20.57 59.65,20.57 58.28,19.21 42.13,19.21 39.73,21.61 23.83,37.5 23.83,46.93 24.46,47.56 24.46,48.09 26.07,49.7 v26.07,56.94
IO14  (via drill 0.35)
  Top 0.254: v27.24,56.34 27.68,55.89 27.68,55.39 30.94,52.13 32.61,52.13 U3.18
  Bottom 0.254: J5.11 66.81,12.17 65.62,13.36 65.62,16.41 61.08,20.95 59.49,20.95 58.13,19.59 42.29,19.59 39.89,21.99 39.88,21.99 24.21,37.66 24.21,45.26 25.81,46.86 25.81,48.91 26.63,49.72 26.63,50.92 27.24,51.53 v27.24,56.34
IO15  (via drill 0.35)
  Top 0.254: v28.44,55.76 28.81,55.38 28.81,54.8 31.09,52.52 33.43,52.52 U3.19
  Bottom 0.254: J5.10 68.6,11.87 66,14.47 66,16.57 61.07,21.49 59.44,21.49 57.91,19.97 42.45,19.97 40.04,22.37 24.6,37.82 24.6,45.1 26.2,46.7 26.2,48.75 27.01,49.56 27.01,50.76 28.44,52.19 v28.44,55.76
IO16  (via drill 0.35)
  Top 0.254: v29.57,55.11 30.07,54.62 30.07,54.26 31.43,52.9 34.25,52.9 U3.20
  Bottom 0.254: J5.9 66.38,15.4 66.38,16.72 61.23,21.87 59.28,21.87 57.75,20.35 42.61,20.35 40.2,22.75 24.98,37.98 24.98,44.95 26.58,46.55 26.58,48.59 27.39,49.4 27.39,50.6 29.57,52.78 v29.57,55.11
IO17  (via drill 0.35)
  Top 0.254: v30.83,54.74 31.14,54.42 31.14,53.72 31.59,53.28 35.08,53.28 U3.21
  Bottom 0.254: J5.8 64.64,20.73 62.91,20.73 61.39,22.25 59.12,22.25 57.6,20.73 42.76,20.73 40.36,23.13 25.36,38.13 25.36,44.79 26.96,46.39 26.96,48.43 27.77,49.24 27.77,50.45 30.83,53.5 v30.83,54.74
IO18  (via drill 0.35)
  Top 0.254: U3.22 35.58,53.98 32.67,53.98 32.6,54.04 v31.9,54.04
  Bottom 0.254: J5.7 67.85,21.11 63.07,21.11 61.55,22.64 58.96,22.64 57.44,21.11 42.92,21.11 40.52,23.52 40.51,23.52 25.74,38.29 25.74,44.63 27.34,46.23 27.34,48.27 28.15,49.09 28.15,50.29 v31.9,54.04
IO21  (via drill 0.35)
  Top 0.254: R18.2 56.88,61.66 U$1.7 56.88,64.23 v56.47,64.64 | v40.09,54.22 38.94,54.22 U3.25
  Bottom 0.254: v56.47,64.64 56.47,62.73 51.39,57.65 43.35,57.65 43.09,57.4 41.99,57.4 40.09,55.49 v40.09,54.22
IO33  (via drill 0.35)
  Top 0.254: U3.28 39.88,56.89 37.83,56.89 35.8,54.86 33.11,54.86 v32.98,54.73
  Bottom 0.254: J5.6 71.06,21.49 63.23,21.49 61.7,23.02 58.8,23.02 57.28,21.49 43.08,21.49 40.67,23.9 26.12,38.45 26.12,44.47 27.72,46.07 27.72,48.12 32.98,53.38 v32.98,54.73
IO34  (via drill 0.35)
  Top 0.254: U3.29 40.38,57.59 38.89,57.59 38.57,57.27 37.67,57.27 36.15,55.75 34,55.75 v33.87,55.62
  Bottom 0.254: J5.5 75.83,20.32 72.78,20.32 71.22,21.87 63.39,21.87 61.86,23.4 58.65,23.4 57.12,21.87 43.24,21.87 40.83,24.28 26.5,38.61 26.5,44.31 28.1,45.91 28.1,47.96 33.87,53.73 v33.87,55.62
IO35  (via drill 0.35)
  Top 0.254: U3.31 40.5,58.41 39.18,58.41 38.41,57.65 37.51,57.65 36.5,56.64 34.89,56.64 v34.76,56.51
  Bottom 0.254: J5.4 77.48,22.25 63.54,22.25 62.02,23.78 58.49,23.78 56.97,22.25 43.4,22.25 40.99,24.66 26.88,38.77 26.88,44.16 28.48,45.76 28.48,47.8 34.76,54.08 v34.76,56.51
IO36  (via drill 0.35)
  Top 0.254: U3.32 39.68,58.8 39.02,58.8 38.26,58.03 37.35,58.03 36.85,57.53 35.77,57.53 v35.65,57.4
  Bottom 0.254: J5.3 80.7,22.64 63.7,22.64 62.18,24.16 58.33,24.16 56.81,22.64 43.55,22.64 41.15,25.04 27.26,38.92 27.26,44 28.86,45.6 28.86,47.64 35.65,54.43 v35.65,57.4
IO37  (via drill 0.35)
  Top 0.254: U3.33 38.1,58.41 36.66,58.41 v36.53,58.29
  Bottom 0.254: J5.2 82.67,24.25 76.28,24.25 75.05,23.02 63.86,23.02 62.33,24.54 58.17,24.54 56.65,23.02 43.71,23.02 41.31,25.42 41.3,25.42 27.77,38.95 27.77,43.97 29.24,45.44 29.24,47.49 36.53,54.78 v36.53,58.29
IO38  (via drill 0.35)
  Top 0.254: v37.42,59.18 37.66,59.18 U3.34 39.94,61.46 41.87,61.46 v42.25,61.08 | R2.2 51.27,63.29 U$1.2 51.39,63.41 v51.39,64.89
  Bottom 0.254: J5.1 75.62,25.75 73.27,23.4 64.02,23.4 62.49,24.92 58.02,24.92 56.49,23.4 43.88,23.4 34.25,33.02 | 34.15,33.12 34.25,33.02 | 34.25,33.02 34.24,33.02 28.15,39.11 28.15,43.81 29.62,45.28 29.62,47.33 37.42,55.13 v37.42,59.18 | v42.25,61.08 44.03,61.08 44.41,60.7 46.06,60.7 47.71,59.05 49.74,59.05 51.39,60.7 v51.39,64.89
IO39  (via drill 0.35)
  Top 0.254: J6.8 72.78,56.64 58,56.64 v57.3,57.34 56.85,57.78 46.62,57.78 42.18,62.23 39.5,62.23 U3.35 | R17.2 54.68,61.95 U$1.5 54.57,63.5 54.69,63.62 v54.69,65.15
  Bottom 0.254: v54.69,65.15 54.69,65.27 54.95,65.52 56.91,65.52 57.3,65.14 v57.3,57.34
IO40
  Top 0.254: J6.7 75.79,63.12 69.68,57.02 58.69,57.02 57.55,58.16 46.78,58.16 42.08,62.86 38.94,62.86 U3.36
IO41
  Top 0.254: J6.6 66.36,57.4 58.85,57.4 57.7,58.54 46.94,58.54 41.99,63.5 38.37,63.5 U3.37
IO42
  Top 0.254: J6.5 65.99,60.62 65.99,59.56 64.21,57.78 59,57.78 57.86,58.92 47.1,58.92 46.95,59.07 46.95,60 | 52.54,63.46 U$1.3 52.48,62.25 R16.2 53.17,61.46 52.41,60.7 47.65,60.7 46.95,60 | U3.38 37.93,64.26 41.76,64.26 46.02,60 46.95,60
IO47  (via drill 0.35)
  Top 0.254: v41.74,54.86 40.71,54.86 U3.27
  Bottom 0.254: v41.74,54.86 42.76,55.88 42.94,55.88 43.83,56.76 56.09,56.76 56.73,56.13 57.87,56.13 58.5,56.76 58.5,58.29 58.38,58.41 58.38,61.14 65.86,68.62 J6.4
IO48  (via drill 0.35)
  Top 0.254: v42.63,56.64 42.54,56.64 U3.30
  Bottom 0.254: J6.3 67.12,70.42 58,61.3 58,58.16 58.12,58.03 58.12,56.92 57.71,56.51 56.88,56.51 56.25,57.14 43.38,57.14 43.25,57.02 43.01,57.02 v42.63,56.64
N$1
  Top 0.508: R27.2 43.44,8.32 LED3.A
N$2
  Top 0.508: R23.2 39.42,9.28 LED4.A
N$4
  Top 0.254: J2.B5 52.76,9.33 R3.1
N$5
  Top 0.305: 34.38,8.01 34.38,8.12 33.69,8.81 33.68,8.81 32.47,10.03 32.47,11.51
  Top 0.508: LED4.C | LED1.C | LED1.C LED3.C LED2.C LED4.C | LED4.C LED5.C 35.9,5.58 34.38,7.1 34.38,8.01 | 32.47,11.51 S3.1
N$6
  Top 0.508: R28.2 41.41,8.01 LED2.A
N$7
  Top 0.508: U1.3 53.84,18.79 R19.2 54.15,19.17 R21.2
N$8
  Top 0.508: C1.1 51.12,20.77 U1.4
N$9
  Top 0.254: R20.2 57.98,62.46 U$1.8
N$10
  Top 0.508: U1.6 45.17,18.79 42.62,21.34 C2.1 C3.1
N$11
  Top 0.61: C2.2 43.03,23.09 44.16,21.97 R22.2
N$12
  Top 0.254: R6.2 37.69,8.91 LED5.A
N$13
  Top 0.254: R5.2 44.55,8.31 LED1.A
N$14
  Top 0.254: R24A.1 38.27,25.09 R24B.2
N$25
  pour Top (no thermals): 71.79,33.51 71.78,33.48 70.65,32.35 70.65,30.38 70.73,30.3 71.81,30.3 74.84,33.33 74.87,33.35 81.29,33.35 81.29,42.21 80.13,42.21 73.03,35.11 73,35.1 71.79,35.1
N$30
  Top 0.508: C4.2 51.83,15.56 U1.1
N$35
  Top 0.508: R19.1 54.1,17.52 U1.2
  Top 0.813: D10.C 58.21,17.41 C16.1 C15.1 54.21,17.41 R19.1
N$80
  Top 0.254: R4.2 49.76,9.32 J2.A5
PH
  Top 0.508: C4.1 47.65,14.73 46.89,15.49 U1.8 46.89,14.96 D9.C
  Top 1.27: U1.8 45.69,16.25 45.44,16 42.94,16 L2.1
RXD0
  Top 0.254: U3.40 36.8,65.53 41.57,65.53 45.77,61.33 46.94,61.33 47.2,61.59 47.2,62.86 47.2,63.65 50.34,66.79 58.22,66.79 59.36,67.94 60.95,67.94 63.49,65.4 65.23,65.4 65.23,73.78 J6.1
SD  (via drill 0.35)
  Top 0.254: U$1.4 53.58,62.81 54.23,62.16 54.23,60.15 53.93,59.85 | 59.61,59.85 61.89,59.85 v62.06,59.69 | v70.32,24.51 70.32,22.35 56.85,8.89 56.85,5.46 56.09,4.69 50.63,4.69 47.58,1.65 v47.46,1.65 | R6.1 36.19,11 35.67,11.52
  Top 0.508: R20.1 59.61,59.85 | v47.96,59.94 49.27,59.94 R1.1 | v35.64,11.52 35.67,11.52 | v44.41,69.21 44.24,69.37 44.24,71.44 43.25,72.43 S4.2
  Top 0.813: R1.1 R2.1 R16.1 53.93,59.85 R17.1 R18.1 R20.1
  Bottom 0.254: v62.06,59.69 62.06,52.83 67.36,47.53 67.36,33.12 66.12,31.89 66.12,28.7 v70.32,24.51 | v47.46,1.65 43.26,1.65 35.64,9.27 v35.64,11.52
  Bottom 0.508: v47.96,59.94 46.44,61.46 44.79,61.46 44.41,61.84 v44.41,69.21
TXD0
  Top 0.254: J6.2 65.61,71.02 65.61,65.02 63.33,65.02 60.79,67.56 59.52,67.56 58.37,66.41 50.5,66.41 47.58,63.5 47.58,61.42 47.11,60.95 45.61,60.95 41.79,64.77 37.24,64.77 U3.39
VBUS  (via drill 0.35)
  Top 0.254: J2.B4_A9 53.41,8.49 53.93,9.01 | J2.A4_B9 48.61,9 v48.34,9.27 | v44.15,13.2 44.15,11.73 R27.1
  Top 0.508: v54.19,9.27 53.93,9.01
  Top 0.813: v36.41,13.33 36.35,13.33 D2.A
  Bottom 0.508: v48.34,9.27 v54.19,9.27
  Bottom 0.813: v36.41,13.33 37.04,13.96 43.52,13.96 44.15,13.33 v44.15,13.2 44.15,11.81 45.04,10.92 46.51,10.92 48.16,9.27 v48.34,9.27
VCC  (1 unrouted)
  Top 0.254: 61.68,18.41 60.41,17.14 60.41,15.74 58.6,13.93 52.01,13.93 51.02,12.95 46.44,12.95 46.44,13.77 45.99,14.22 45.36,14.22 44.92,13.77 44.92,13.52 44.91,13.52 44.47,13.96 41.75,13.96 39.38,11.59
  Top 0.508: D10.A 61.68,18.41 | 39.38,11.59 R23.1
  Top 1.27: D7.1 68.97,24.07 63.31,18.41 D10.A | D8.1 68.16,46.53 68.16,53.46 70.32,55.62 74.76,55.62 75.22,55.16 JP3.1 JP3.2 JP3.3 80.4,49 84.77,53.36 J6.12
  pour Top (no thermals): 67.98,35.05 70.11,34.25 70.11,46.14 67.98,45.34
VSENSE
  Top 0.254: R24B.1 38.27,26.36 39.62,25.01 R25.2 39.33,24.47 39.33,22.35 39.45,22.22 42.88,22.22 45.04,20.06 U1.5

### Text on the board
tPlace: reLoaD Spinner | Nicklas Rondot | Dario Mager
tNames: RXD | TXD | 48 | 47 | enable SD | 42 | 41 | 40 | 39 | GND | +3V3 | +5V | VCC | 1 | 2 | 3 | 4 | 5 | 6 | 7 | 8 | 9 | 10 | 11 | GND | 38 | 12 | 12 | 37 | 36 | 35 | 34 | 33 | 18 | 17 | 16 | 15 | 14 | 13
bNames: RXD | TXD | 48 | 47 | 42 | 41 | 40 | 39 | GND | +3V3 | +5V | VCC | 1 | 2 | 3 | 4 | 5 | 6 | 7 | 8 | 9 | 10 | 11 | GND | 38 | 12 | 12 | 37 | 36 | 35 | 34 | 33 | 18 | 17 | 16 | 15 | 14 | 13